# EAGLE board ESP32 Display 5.0 inch V1.2 (EAGLE 9.5.1), part 1 of 2
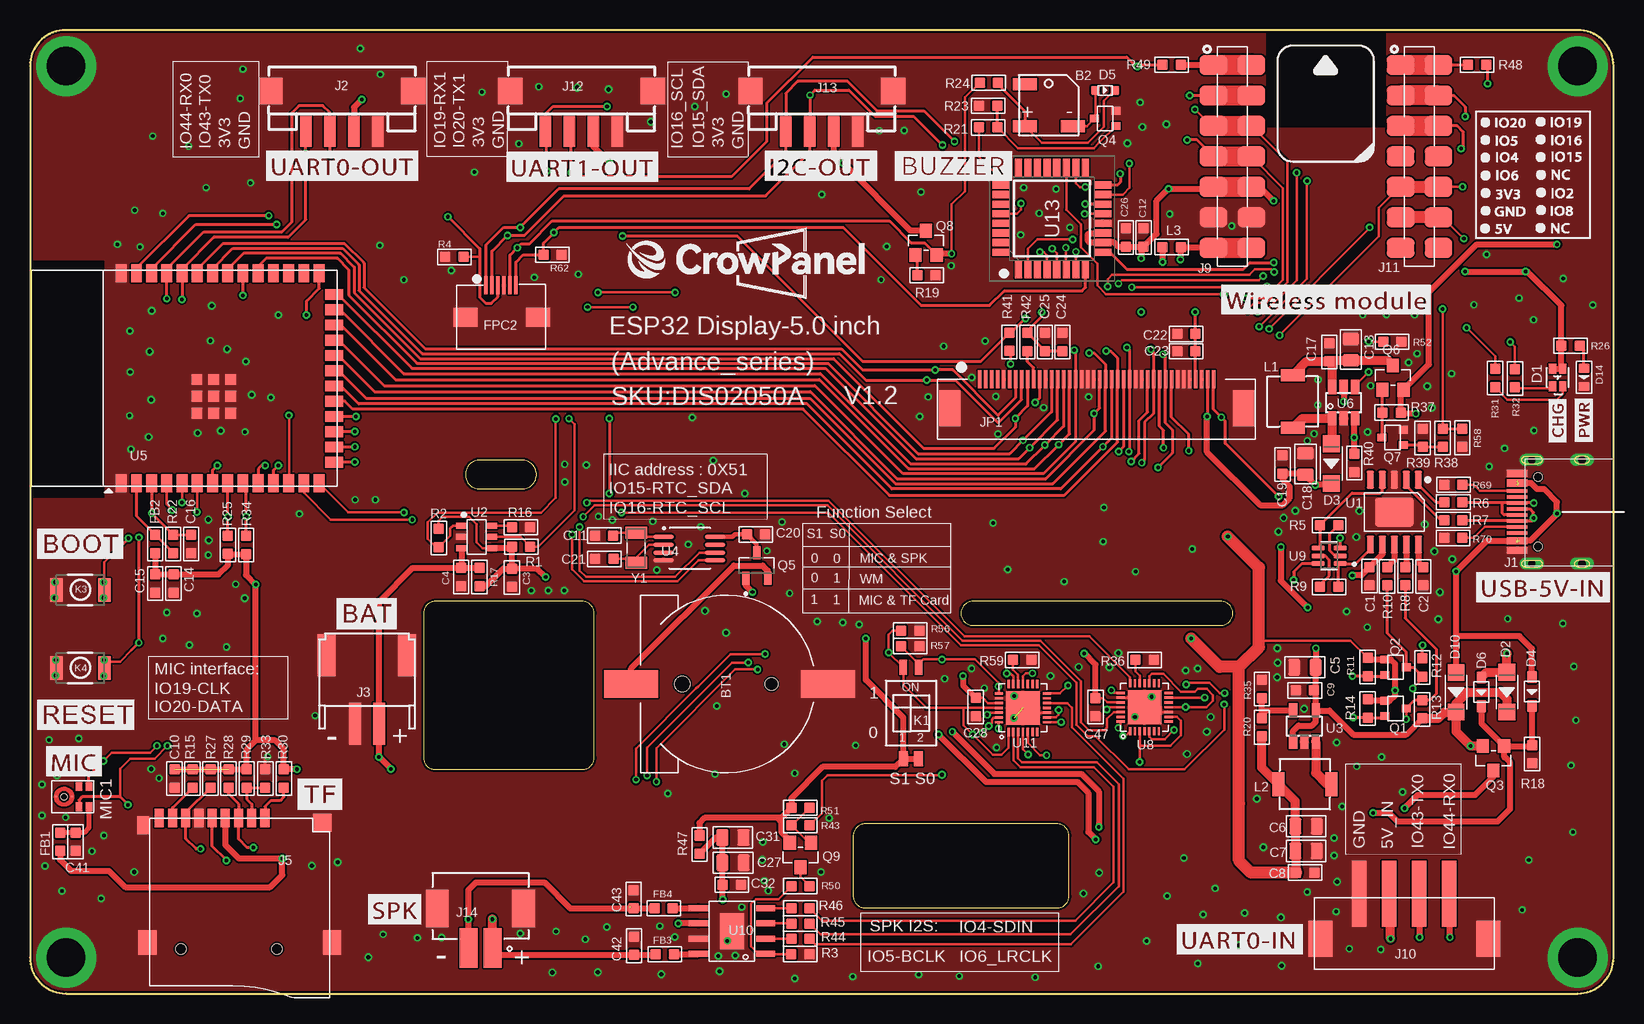
[diagram p5: board, top side]
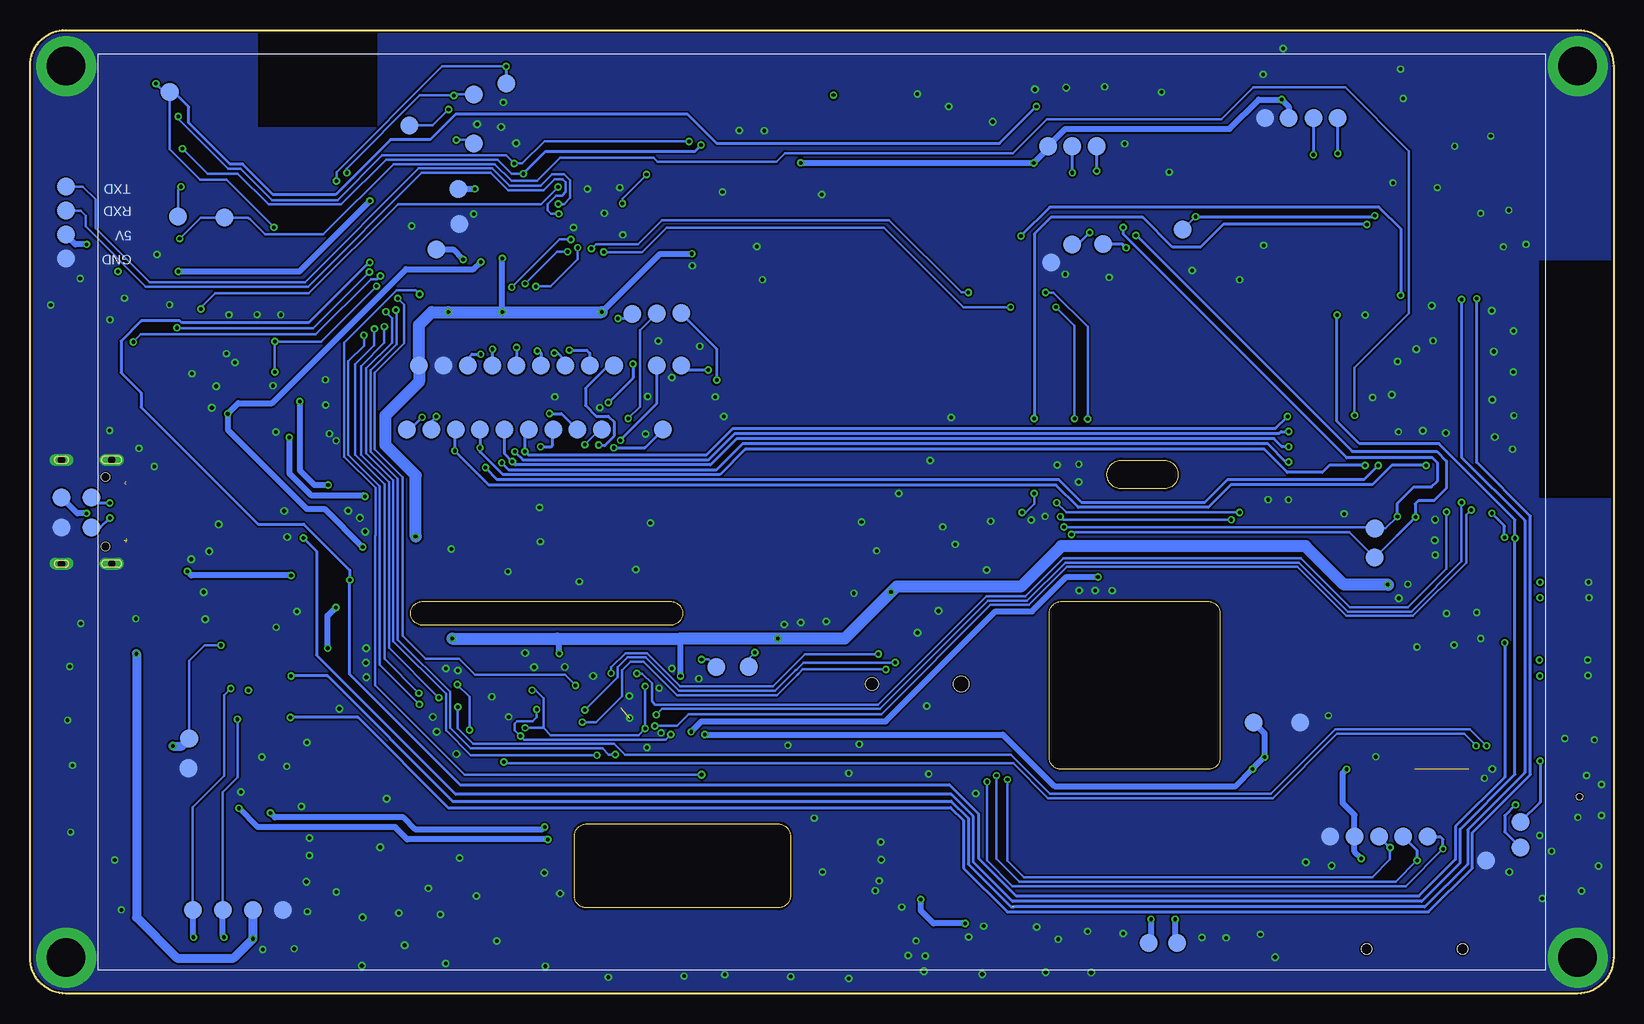
[diagram p6: board, bottom side, seen from below]

Size 132 x 80.3 mm. Coordinates in mm from the lower left corner, seen from the top.
Outline: 129,80.3 3,80.3 arc90 0,77.3 0,3 arc90 3,0 129,0 arc90 132,3 132,77.3 arc90 129,80.3
Outline: 78.61,30.69 99.27,30.69 arc180 99.27,32.69 78.61,32.69 arc180 78.61,30.69
Outline: 32.8,31.68 32.8,19.68 arc90 33.8,18.68 46.03,18.68 arc90 47.03,19.68 47.03,31.68 arc90 46.03,32.68 33.8,32.68 arc90 32.8,31.68
Outline: 69.61,7.14 85.61,7.14 arc90 86.61,8.14 86.61,13.14 arc90 85.61,14.14 69.61,14.14 arc90 68.61,13.14 68.61,8.14 arc90 69.61,7.14
Outline: 37.5,42.05 41.02,42.05 arc180 41.02,44.46 37.5,44.46 arc180 37.5,42.05
Copper layers (1*16): Top 0.035mm / dielectric 1.5mm / Bottom 0.035mm
Design rules "default *": minimum track width 8mil, minimum drill 0.3mm, track to track 6mil, track to pad 6mil, pad to pad 4mil, via to via 6mil, smd to smd 6mil, copper to edge 6mil, drill to drill 4mil, minimum pad ring 6mil, minimum via ring 6mil, stop-mask expansion 4mil, vias tented up to drill 100mil, thermal gap 0mil
tKeepout: area 0.5,41.9 to 6.5,62.6
tRestrict: area 0,41.3 to 6.2,61.1; area 103.1,72.2 to 113,80.3
bRestrict: area 0,41.3 to 6.2,61.1; area 103,72.2 to 113,80.3

## Footprints (pad centres in the part's own frame; a part is rotated, then mirrored left to right if it is on the bottom)
BEEP_5025 = smd 2 x 1: 1 -2,-1.75; 2 2,-1.75; 3 -2,1.75
CR1220 = smd 2.3 x 4.5: N 0,8.425; P 0,-7.975 | hole 1.3: 0,-3.725 | hole 1.05: 0,3.725
C0603 = smd 0.889 x 0.889: 1 -0.762,0; 2 0.762,0
C0805 = smd 1.016 x 1.397: 1 -0.889,0; 2 0.889,0
LED_KT-0603RYG = smd 0.85 x 0.6: 1 0.725,-0.425; 2 0.725,0.425; 3 -0.725,-0.425; 4 -0.725,0.425
D_SOD123FL = smd 1.397 x 1.397: + -1.651,0; - 1.651,0
D_SOD323 = smd 1 x 0.8: + -1.2,0; - 1.2,0
D_SOD523 = smd 0.762 x 0.7: + -0.8,0; - 0.8,0
LED0603 = smd 0.762 x 0.889: + -0.762,0; - 0.762,0
L0603 = smd 0.889 x 0.889: 1 -0.762,0; 2 0.762,0
FPC-6PIN-0.5MM = smd 0.3 x 1.5: 1 -1.31,2.184; 2 -0.81,2.184; 3 -0.31,2.184; 4 0.19,2.184; 5 0.69,2.184; 6 1.19,2.184 | smd 2 x 1.6: 7 -3.01,-0.496; 8 3.036,-0.496
USB-3.0TYPEC-SMD = smd 0.3 x 1.7: A1 -3.35,0.5; A4 -2.55,0.5; A5 -1.25,0.5; A6 -0.25,0.5; A7 0.25,0.5; A8 1.25,0.5; A9 2.55,0.5; A12 3.35,0.5; B1 3.05,0.5; B4 2.25,0.5; B5 1.75,0.5; B6 0.75,0.5; B7 -0.75,0.5; B8 -1.75,0.5; B9 -2.25,0.5; B12 -3.05,0.5 | drill 0.6 pad 1.016 long: P$1 -4.325,-0.72; P$2 4.325,-0.72; P$3 -4.325,-4.9; P$4 4.325,-4.9 | hole 0.68: -2.89,-1.22; 2.89,-1.22
CONNECTOR_4P-SMD-2.0 = smd 0.965 x 2.54: 1 -3,0; 2 -1,0; 3 1,0; 4 3,0 | smd 2.032 x 2.184: SS1 -5.946,3.4; SS2 5.946,3.4
PH2.0WT-2PIN = smd 1 x 3.5: P$1 -1,0; P$2 1,0 | smd 1.5 x 3.5: P$3 -3.35,-5.7; P$4 3.35,-5.7
THO-M3.2*5MM-HOLE = drill 3.2 pad 5: P$1 0,0
9P-SMD-W/-RING = smd 1.524 x 0.762: 1 0,4.4; 2 0,3.3; 3 0,2.2; 4 0,1.1; 5 0,0; 6 0,-1.1; 7 0,-2.2; 8 0,-3.3; 9 0,-4.4 | smd 1.524 x 1.016: G1 0.6,-5.746 | smd 2.032 x 1.524: G2 10.373,-5.4; G3 10.373,10 | smd 1.524 x 1.524: G4 0.392,9.181 | hole 0.889: 10.9,-2.6; 10.9,5.4
H7-2.54-18.28X2.5X5MM = smd 1.65 x 2.3: 1 -7.62,-1.58; 1-1 -7.62,1.58; 2 -5.08,-1.58; 2-2 -5.08,1.58; 3 -2.54,-1.58; 3-3 -2.54,1.58; 4 0,-1.58; 4-4 0,1.58; 5 2.54,-1.58; 5-5 2.54,1.58; 6 5.08,-1.58; 6-6 5.08,1.58; 7 7.62,-1.58; 7-7 7.62,1.58
XH2.54-4P-SMD = smd 1.2 x 5.5: 1 -3.75,-1.875; 2 -1.25,-1.875; 3 1.25,-1.875; 4 3.75,-1.875 | smd 2 x 3: 5 -7,1.875; 6 7,1.875
CONN-TH_2P-P2.00_XUNPU_WAFER-PH2.0-2PLB = smd 1.5 x 3.3: 1 -1,1.65; 2 1,1.65 | smd 1.9 x 3.1: 3 3.6,-1.65; 4 -3.6,-1.65
TEST-PIN-4-2.0MM = smd 1.5 x 1.5: 1 -3,0; 2 -1,0; 3 1,0; 4 3,0
COOPER_0.5MM*40P = smd 0.3 x 1.5: P$1 -8.81,1.73; P$2 -8.31,1.73; P$3 -7.81,1.73; P$4 -7.31,1.73; P$5 -6.81,1.73; P$6 -6.31,1.73; P$7 -5.81,1.73; P$8 -5.31,1.73; P$9 -4.81,1.73; P$10 -4.31,1.73; P$11 -3.81,1.73; P$12 -3.31,1.73; P$13 -2.81,1.73; P$14 -2.31,1.73; P$15 -1.81,1.73; P$16 -1.31,1.73; P$17 -0.81,1.73; P$18 -0.31,1.73; P$19 0.19,1.73; P$20 0.69,1.73; P$21 1.19,1.73; P$22 1.69,1.73; P$23 2.19,1.73; P$24 2.69,1.73; P$25 3.19,1.73; P$26 3.69,1.73; P$27 4.19,1.73; P$28 4.69,1.73; P$29 5.19,1.73; P$30 5.69,1.73; P$31 6.19,1.73; P$32 6.69,1.73; P$33 7.19,1.73; P$34 7.69,1.73; P$35 8.19,1.73; P$36 8.69,1.73; P$37 9.19,1.73; P$38 9.69,1.73; P$39 10.19,1.73; P$40 10.69,1.73 | smd 1.8 x 3: P$41 -11.31,-0.67; P$42 13.19,-0.67
SW-SMD_DSHP02TS-S_1 = smd 0.76 x 1.27: 1 -0.635,-3.81; 2 0.635,-3.81 | smd 0.635 x 1.27: 3 0.635,3.81; 4 -0.635,3.81
157SW = smd 1.016 x 1.981: 1 -2,0; 2 2,0
L0420 = smd 2 x 1: 1 0,2.2; 2 0,-2.2
MIC-SMD_5P-L3.5-W2.7-P1.67 = smd 0.725 x 0.522: 1 -0.838,1.362; 2 -0.838,0.542; 3 0.838,0.542; 4 0.838,1.362 | smd 0.25 x 0.25: 5_1 0,-0.048; 5_2 0,-1.373 | hole 0.5: 0,-0.71
TEST_PAD-1.5MM = smd 1.5 x 1.5: P$1 0,0
MOS_SOT323 = smd 0.635 x 0.762: 1 -0.635,-0.889; 2 0.635,-0.889; 3 0,0.889
PMOS_SOT23 = smd 1.016 x 1.143: 1 -0.889,-1.016; 2 0.889,-1.016; 3 0,1.016
SOT-23 = smd 1.09 x 0.61: 1 -1.07,0.915; 2 -1.07,-0.915; 3 1.07,0
R0603-SP = smd 0.889 x 0.889: 1 -0.762,0; 2 0.762,0
ESOP-10-EP-150MIL = smd 1.5 x 0.6: 1 -2.7,2; 2 -2.7,1; 3 -2.7,0; 4 -2.7,-1; 5 -2.7,-2; 6 2.7,-2; 7 2.7,-1; 8 2.7,0; 9 2.7,1; 10 2.7,2 | smd 2.4 x 3.2: EP 0,0
SOT23-6L = smd 0.5 x 0.9: 1 -0.961,-1.212; 2 -0.011,-1.212; 3 0.94,-1.212; 4 0.94,1.288; 5 -0.011,1.288; 6 -0.961,1.288
IC_SOT23-5 = smd 0.69 x 1.2: 1 -0.95,-1.3; 2 0,-1.3; 3 0.95,-1.3; 4 0.95,1.3; 5 -0.95,1.3
MSOP-8 = smd 0.364 x 1.692: 1 -0.975,-2.146; 2 -0.325,-2.146; 3 0.325,-2.146; 4 0.975,-2.146; 5 0.975,2.146; 6 0.325,2.146; 7 -0.325,2.146; 8 -0.975,2.146
ESP32-S3-WROOM-1-SMD41 = smd 1.5 x 0.9: 1 -8.75,5.26; 2 -8.75,3.99; 3 -8.75,2.72; 4 -8.75,1.45; 5 -8.75,0.18; 6 -8.75,-1.09; 7 -8.75,-2.36; 8 -8.75,-3.63; 9 -8.75,-4.9; 10 -8.75,-6.17; 11 -8.75,-7.44; 12 -8.75,-8.71; 13 -8.75,-9.98; 14 -8.75,-11.25; 27 8.75,-11.25; 28 8.75,-9.98; 29 8.75,-8.71; 30 8.75,-7.44; 31 8.75,-6.17; 32 8.75,-4.9; 33 8.75,-3.63; 34 8.75,-2.36; 35 8.75,-1.09; 36 8.75,0.18; 37 8.75,1.45; 38 8.75,2.72; 39 8.75,3.99; 40 8.75,5.26 | smd 0.9 x 1.5: 15 -6.985,-12.5; 16 -5.715,-12.5; 17 -4.445,-12.5; 18 -3.175,-12.5; 19 -1.905,-12.5; 20 -0.635,-12.5; 21 0.635,-12.5; 22 1.905,-12.5; 23 3.175,-12.5; 24 4.445,-12.5; 25 5.715,-12.5; 26 6.985,-12.5 | smd 0.9 x 0.9: 41 -2.9,-1.06; 42 -1.5,-1.06; 43 -0.1,-1.06; 44 -2.9,-2.46; 45 -1.5,-2.46; 46 -0.1,-2.46; 47 -2.9,-3.86; 48 -1.5,-3.86; 49 -0.1,-3.86
COOPER_SOT23-6 = smd 0.69 x 1.2: 1 -0.95,-1.3; 2 0,-1.3; 3 0.95,-1.3; 4 0.95,1.3; 5 0,1.3; 6 -0.95,1.3
QFN-28_L4.0-W4.0-P0.40-BL-EP2.8 = smd 0.2 x 0.7: 1 -1.2,-2; 2 -0.8,-2; 3 -0.4,-2; 4 0,-2; 5 0.4,-2; 6 0.8,-2; 7 1.2,-2; 15 1.2,2; 16 0.8,2; 17 0.4,2; 18 0,2; 19 -0.4,2; 20 -0.8,2; 21 -1.2,2 | smd 0.7 x 0.2: 8 2,-1.2; 9 2,-0.8; 10 2,-0.4; 11 2,0; 12 2,0.4; 13 2,0.8; 14 2,1.2; 22 -2,1.2; 23 -2,0.8; 24 -2,0.4; 25 -2,0; 26 -2,-0.4; 27 -2,-0.8; 28 -2,-1.2 | smd 2.8 x 2.8: 29 0,0
SOP65P210X100-6N = smd 1.09 x 0.4: 1 -0.92,0.65; 2 -0.92,0; 3 -0.92,-0.65; 4 0.92,-0.65; 5 0.92,0; 6 0.92,0.65
NS4168-ESOP-8 = smd 1.6 x 0.5: 1 -2.8,1.905; 2 -2.8,0.635; 3 -2.8,-0.635; 4 -2.8,-1.905; 5 2.8,-1.905; 6 2.8,-0.635; 7 2.8,0.635; 8 2.8,1.905 | smd 2 x 3: 9 0,0
QFP80P900X900X165-32N = smd 1.475 x 0.6: 1 -4.238,2.8; 2 -4.238,2; 3 -4.238,1.2; 4 -4.238,0.4; 5 -4.238,-0.4; 6 -4.238,-1.2; 7 -4.238,-2; 8 -4.238,-2.8; 17 4.238,-2.8; 18 4.238,-2; 19 4.238,-1.2; 20 4.238,-0.4; 21 4.238,0.4; 22 4.238,1.2; 23 4.238,2; 24 4.238,2.8 | smd 0.6 x 1.475: 9 -2.8,-4.238; 10 -2,-4.238; 11 -1.2,-4.238; 12 -0.4,-4.238; 13 0.4,-4.238; 14 1.2,-4.238; 15 2,-4.238; 16 2.8,-4.238; 25 2.8,4.238; 26 2,4.238; 27 1.2,4.238; 28 0.4,4.238; 29 -0.4,4.238; 30 -1.2,4.238; 31 -2,4.238; 32 -2.8,4.238
SMD3215-2P = smd 1 x 1.8: 1 -1.25,0; 2 1.25,0

## Placement (x,y rotation side)
B2  BEEP_5025  [BEEP_5025]  84.93,74.04 0 top
BT1  CR1220  [CR1220]  58.1,25.8 270 top
C1  1uF  [C0603]  111.66,34.79 90 top
C2  1uF  [C0603]  116.16,34.78 90 top
C3  1uF  [C0603]  40.17,34.66 90 top
C4  NC/10uF  [C0603]  35.94,34.71 90 top
C5  22uF  [C0805]  106.28,27.19 0 top
C6  22uF  [C0805]  106.37,13.95 180 top
C7  22uF  [C0805]  106.37,11.88 180 top
C8  1uF  [C0603]  106.3,10.08 180 top
C9  1uF  [C0603]  106.27,25.27 0 top
C10  1uF  [C0603]  12.05,17.92 90 top
C11  18pF  [C0603]  47.86,38.17 180 top
C12  10uF  [C0603]  92.83,63 270 top
C13  22uF  [C0805]  110.11,53.66 90 top
C14  10uF  [C0603]  11.96,34.17 90 top
C15  100nF  [C0603]  10.44,34.18 90 top
C16  1uF  [C0603]  13.44,37.46 90 top
C17  1uF  [C0603]  108.32,53.45 270 top
C18  22uF  [C0805]  106.32,44.13 90 top
C19  100nF  [C0603]  104.42,44.1 270 top
C20  1uF  [C0603]  60.52,38.27 0 top
C21  18pF  [C0603]  47.87,36.22 0 top
C22  4.7uF  [C0603]  96.39,54.97 0 top
C23  100nF  [C0603]  96.39,53.54 0 top
C24  10uF  [C0603]  86.06,54.3 270 top
C25  100nF  [C0603]  84.61,54.3 270 top
C26  100nF  [C0603]  91.35,63 270 top
C27  47uF  [C0805]  58.6,10.91 0 top
C28  1uF  [C0603]  78.84,23.87 90 top
C31  47uF  [C0805]  58.59,13 0 top
C32  100nF  [C0603]  58.5,9.06 0 top
C41  100nF  [C0603]  3.8,12.65 90 top
C42  1nF  [C0603]  50.34,3.99 270 top
C43  1nF  [C0603]  50.32,7.87 270 top
C47  1uF  [C0603]  88.83,23.87 270 top
D1  KT-0603RYG  [LED_KT-0603RYG]  127.35,51.35 90 top
D2  DSS34  [D_SOD123FL]  123.11,25.12 270 top
D3  DSS34  [D_SOD123FL]  108.48,44.16 270 top
D4  1N5817WS  [D_SOD323]  125.21,25.18 270 top
D5  B5819WT  [D_SOD523]  89.62,75.27 0 top
D6  1N5817WS  [D_SOD323]  120.98,25.15 270 top
D10  DSS34  [D_SOD123FL]  118.88,25.11 270 top
D14  Red  [LED0603]  129.54,51.36 270 top
FB1  0R/800mA  [L0603]  2.52,12.65 90 top
FB2  0R/800mA  [L0603]  10.44,37.48 90 top
FB3  1K/300mA  [L0603]  52.92,3.29 180 top
FB4  1K/300mA  [L0603]  52.82,7.11 180 top
FPC2  FPC-6PIN-0.5MM  [FPC-6PIN-0.5MM]  39.32,56.85 0 top
J1  TYPEC-3.0-16P-SMD  [USB-3.0TYPEC-SMD]  124.47,40.15 90 top
J2  HY2.0-4P-SMT  [CONNECTOR_4P-SMD-2.0]  26.01,71.82 0 top
J3  PH2.0WT-2PIN  [PH2.0WT-2PIN]  28.09,22.51 180 top
J4  THO-M3.25MM-HOLE  [THO-M3.2*5MM-HOLE]  129,3 0 top
J5  [9P-SMD-W/-RING]  15.18,14.62 270 top
J6  THO-M3.25MM-HOLE  [THO-M3.2*5MM-HOLE]  3,3 0 top
J7  THO-M3.25MM-HOLE  [THO-M3.2*5MM-HOLE]  129,77.3 0 top
J8  THO-M3.25MM-HOLE  [THO-M3.2*5MM-HOLE]  3,77.3 0 top
J9  [H7-2.54-18.28X2.5X5MM]  100.23,69.76 270 top
J10  XH2.54-4P-SMT  [XH2.54-4P-SMD]  114.56,6.45 180 top
J11  [H7-2.54-18.28X2.5X5MM]  115.83,69.76 270 top
J12  HY2.0-4P-SMT  [CONNECTOR_4P-SMD-2.0]  45.97,71.82 0 top
J13  HY2.0-4P-SMT  [CONNECTOR_4P-SMD-2.0]  66.01,71.82 0 top
J14  WAFER-PH2.0-2PLB  [CONN-TH_2P-P2.00_XUNPU_WAFER-PH2.0-2PLB]  37.55,5.44 180 top
J15  HC-PZ200-8.7L-1X4PZ1  [TEST-PIN-4-2.0MM]  129.01,64.24 270 bottom
JP1  COOPER_0.5MM-40PIN40PIN  [COOPER_0.5MM*40P]  87.97,49.45 0 top
K1  DSHP02TS-S  [SW-SMD_DSHP02TS-S_1]  73.44,23.38 0 top
K3  [157SW]  4.21,33.64 0 top
K4  [157SW]  4.21,27.14 0 top
L1  4.7uH/3A  [L0420]  105.26,49.34 0 top
L2  4.7uH/3A  [L0420]  106.27,17.46 270 top
L3  NC  [L0603]  95.17,62.21 180 top
MIC1  LMD3526B261-OFA01  [MIC-SMD_5P-L3.5-W2.7-P1.67]  3.55,16.41 270 top
P1  TEST_PADPAD-1.5MM  [TEST_PAD-1.5MM]  129.38,41.34 0 bottom
P2  TEST_PADPAD-1.5MM  [TEST_PAD-1.5MM]  126.88,41.34 0 bottom
P3  TEST_PADPAD-1.5MM  [TEST_PAD-1.5MM]  126.88,38.84 0 bottom
P4  TEST_PADPAD-1.5MM  [TEST_PAD-1.5MM]  129.38,38.84 0 bottom
P5  TEST_PADPAD-1.5MM  [TEST_PAD-1.5MM]  115.78,64.67 180 bottom
P6  TEST_PADPAD-1.5MM  [TEST_PAD-1.5MM]  10.61,11.09 270 bottom
P7  TEST_PADPAD-1.5MM  [TEST_PAD-1.5MM]  15.49,13.08 0 bottom
P8  TEST_PADPAD-1.5MM  [TEST_PAD-1.5MM]  17.53,13.08 270 bottom
P9  TEST_PADPAD-1.5MM  [TEST_PAD-1.5MM]  29.99,22.58 180 bottom
P10  TEST_PADPAD-1.5MM  [TEST_PAD-1.5MM]  26.11,22.59 180 bottom
P11  TEST_PADPAD-1.5MM  [TEST_PAD-1.5MM]  118.73,21.24 0 bottom
P12  TEST_PADPAD-1.5MM  [TEST_PAD-1.5MM]  118.79,18.78 0 bottom
P13  TEST_PADPAD-1.5MM  [TEST_PAD-1.5MM]  21.59,13.08 0 bottom
P14  TEST_PADPAD-1.5MM  [TEST_PAD-1.5MM]  119.66,64.74 180 bottom
P17  TEST_PADPAD-1.5MM  [TEST_PAD-1.5MM]  113.42,6.97 0 bottom
P18  TEST_PADPAD-1.5MM  [TEST_PAD-1.5MM]  110.92,6.97 0 bottom
P19  TEST_PADPAD-1.5MM  [TEST_PAD-1.5MM]  115.92,6.97 0 bottom
P20  TEST_PADPAD-1.5MM  [TEST_PAD-1.5MM]  118.42,6.97 0 bottom
P21  TEST_PADPAD-1.5MM  [TEST_PAD-1.5MM]  74.81,27.21 0 bottom
P22  TEST_PADPAD-1.5MM  [TEST_PAD-1.5MM]  100.38,72.35 0 bottom
P23  TEST_PADPAD-1.5MM  [TEST_PAD-1.5MM]  95,74.94 0 bottom
P24  TEST_PADPAD-1.5MM  [TEST_PAD-1.5MM]  95,70.85 0 bottom
P25  TEST_PADPAD-1.5MM  [TEST_PAD-1.5MM]  72.09,27.24 0 bottom
P26  TEST_PADPAD-1.5MM  [TEST_PAD-1.5MM]  19.56,13.08 270 bottom
P27  TEST_PADPAD-1.5MM  [TEST_PAD-1.5MM]  7.76,12.18 180 bottom
P28  TEST_PADPAD-1.5MM  [TEST_PAD-1.5MM]  23.62,13.08 0 bottom
P29  TEST_PADPAD-1.5MM  [TEST_PAD-1.5MM]  7.76,14.31 0 bottom
P31  TEST_PADPAD-1.5MM  [TEST_PAD-1.5MM]  38.74,4.22 0 bottom
P32  TEST_PADPAD-1.5MM  [TEST_PAD-1.5MM]  27.08,72.97 0 bottom
P33  TEST_PADPAD-1.5MM  [TEST_PAD-1.5MM]  25.02,72.95 180 bottom
P34  TEST_PADPAD-1.5MM  [TEST_PAD-1.5MM]  22.99,72.95 180 bottom
P35  TEST_PADPAD-1.5MM  [TEST_PAD-1.5MM]  43.08,70.61 0 bottom
P36  TEST_PADPAD-1.5MM  [TEST_PAD-1.5MM]  45.11,70.61 0 bottom
P37  TEST_PADPAD-1.5MM  [TEST_PAD-1.5MM]  29.03,72.97 0 bottom
P38  TEST_PADPAD-1.5MM  [TEST_PAD-1.5MM]  42.55,62.46 0 bottom
P39  TEST_PADPAD-1.5MM  [TEST_PAD-1.5MM]  19.9,36.33 0 bottom
P40  TEST_PADPAD-1.5MM  [TEST_PAD-1.5MM]  19.9,38.77 0 bottom
P41  TEST_PADPAD-1.5MM  [TEST_PAD-1.5MM]  46.89,60.94 0 bottom
P42  TEST_PADPAD-1.5MM  [TEST_PAD-1.5MM]  36.39,4.22 0 bottom
P43  TEST_PADPAD-1.5MM  [TEST_PAD-1.5MM]  47.14,70.61 0 bottom
P44  TEST_PADPAD-1.5MM  [TEST_PAD-1.5MM]  99.57,52.32 0 bottom
P45  TEST_PADPAD-1.5MM  [TEST_PAD-1.5MM]  97.54,52.32 0 bottom
P46  TEST_PADPAD-1.5MM  [TEST_PAD-1.5MM]  100.58,46.99 0 bottom
P47  TEST_PADPAD-1.5MM  [TEST_PAD-1.5MM]  98.55,46.99 0 bottom
P48  TEST_PADPAD-1.5MM  [TEST_PAD-1.5MM]  96.52,46.99 0 bottom
P49  TEST_PADPAD-1.5MM  [TEST_PAD-1.5MM]  95.5,52.32 0 bottom
P50  TEST_PADPAD-1.5MM  [TEST_PAD-1.5MM]  94.49,46.99 0 bottom
P51  TEST_PADPAD-1.5MM  [TEST_PAD-1.5MM]  93.47,52.32 0 bottom
P52  TEST_PADPAD-1.5MM  [TEST_PAD-1.5MM]  92.46,46.99 0 bottom
P53  TEST_PADPAD-1.5MM  [TEST_PAD-1.5MM]  91.44,52.32 0 bottom
P54  TEST_PADPAD-1.5MM  [TEST_PAD-1.5MM]  90.42,46.99 0 bottom
P55  TEST_PADPAD-1.5MM  [TEST_PAD-1.5MM]  89.41,52.32 0 bottom
P56  TEST_PADPAD-1.5MM  [TEST_PAD-1.5MM]  88.39,46.99 0 bottom
P57  TEST_PADPAD-1.5MM  [TEST_PAD-1.5MM]  87.38,52.32 0 bottom
P58  TEST_PADPAD-1.5MM  [TEST_PAD-1.5MM]  120.35,75.14 0 bottom
P59  TEST_PADPAD-1.5MM  [TEST_PAD-1.5MM]  92.3,75.85 180 bottom
P60  TEST_PADPAD-1.5MM  [TEST_PAD-1.5MM]  96.23,64.14 0 bottom
P61  TEST_PADPAD-1.5MM  [TEST_PAD-1.5MM]  96.28,67.07 0 bottom
P62  TEST_PADPAD-1.5MM  [TEST_PAD-1.5MM]  98.13,62.01 0 bottom
P63  TEST_PADPAD-1.5MM  [TEST_PAD-1.5MM]  86.36,46.99 0 bottom
P64  TEST_PADPAD-1.5MM  [TEST_PAD-1.5MM]  85.34,52.32 0 bottom
P65  TEST_PADPAD-1.5MM  [TEST_PAD-1.5MM]  84.33,46.99 0 bottom
P66  TEST_PADPAD-1.5MM  [TEST_PAD-1.5MM]  83.31,52.32 0 bottom
P67  TEST_PADPAD-1.5MM  [TEST_PAD-1.5MM]  79.25,46.99 0 bottom
P68  TEST_PADPAD-1.5MM  [TEST_PAD-1.5MM]  79.76,52.32 0 bottom
P69  TEST_PADPAD-1.5MM  [TEST_PAD-1.5MM]  81.79,56.65 0 bottom
P70  TEST_PADPAD-1.5MM  [TEST_PAD-1.5MM]  79.76,56.68 0 bottom
P71  TEST_PADPAD-1.5MM  [TEST_PAD-1.5MM]  77.72,56.7 0 bottom
P72  TEST_PADPAD-1.5MM  [TEST_PAD-1.5MM]  77.72,52.32 0 bottom
P75  TEST_PADPAD-1.5MM  [TEST_PAD-1.5MM]  35.92,63.67 0 bottom
P76  TEST_PADPAD-1.5MM  [TEST_PAD-1.5MM]  45.14,62.42 0 bottom
Q1  BSS138W_SOT323  [MOS_SOT323]  113.84,23.76 270 top
Q2  BSS138W_SOT323  [MOS_SOT323]  113.84,27.19 270 top
Q3  AO3401  [PMOS_SOT23]  121.99,19.61 180 top
Q4  SS8050W-SOT323  [MOS_SOT323]  89.63,72.94 90 top
Q5  BAT54C-7-F  [SOT-23]  60.57,35.67 90 top
Q6  AO3401  [PMOS_SOT23]  113.61,51.34 0 top
Q7  SS8050W-SOT323  [MOS_SOT323]  113.59,46.36 90 top
Q8  AO3401  [PMOS_SOT23]  74.69,62.56 0 top
Q9  AO3401  [PMOS_SOT23]  64.23,11.55 180 top
R1  5.1K  [R0603-SP]  40.94,37.24 180 top
R2  5.1K  [R0603-SP]  34.08,37.97 90 top
R3  100K  [R0603-SP]  64.22,3.29 0 top
R4  5.1K  [R0603-SP]  35.38,61.39 0 top
R5  10K  [R0603-SP]  108.29,39.04 180 top
R6  0R  [R0603-SP]  118.65,40.94 0 top
R7  0R  [R0603-SP]  118.65,39.46 0 top
R8  0R  [R0603-SP]  114.64,34.79 90 top
R9  10K  [R0603-SP]  108.29,33.89 0 top
R10  0R  [R0603-SP]  113.13,34.78 90 top
R11  4.7K  [R0603-SP]  111.5,27.21 270 top
R12  4.7K  [R0603-SP]  116.07,27.17 270 top
R13  4.7K  [R0603-SP]  116.05,23.69 90 top
R14  4.7K  [R0603-SP]  111.5,23.76 270 top
R15  10K  [R0603-SP]  13.55,17.92 90 top
R16  2K  [R0603-SP]  40.93,38.86 180 top
R17  5.1K  [R0603-SP]  37.46,34.72 270 top
R18  10K  [R0603-SP]  125.21,19.95 90 top
R19  10K  [R0603-SP]  74.73,59.87 180 top
R20  45.3K  [R0603-SP]  102.68,22.2 270 top
R21  1K  [R0603-SP]  79.87,72.18 180 top
R22  10K  [R0603-SP]  11.95,37.46 90 top
R23  47K  [R0603-SP]  79.87,73.99 180 top
R24  3.9R  [R0603-SP]  79.94,75.9 180 top
R25  4.7K  [R0603-SP]  16.5,37.4 270 top
R26  5.1K  [R0603-SP]  128.41,53.98 180 top
R27  10K  [R0603-SP]  15.04,17.92 90 top
R28  10K  [R0603-SP]  16.54,17.92 90 top
R29  10K/NC  [R0603-SP]  18.07,17.92 90 top
R30  10K  [R0603-SP]  21.17,17.92 90 top
R31  2K  [R0603-SP]  122.13,51.29 90 top
R32  5.1K  [R0603-SP]  123.79,51.27 90 top
R33  10K  [R0603-SP]  19.62,17.92 90 top
R34  4.7K  [R0603-SP]  18.02,37.38 270 top
R35  10K  [R0603-SP]  102.68,25.39 270 top
R36  10K  [R0603-SP]  92.91,27.8 0 top
R37  100K  [R0603-SP]  113.51,48.42 0 top
R38  100R  [R0603-SP]  117.76,46.31 90 top
R39  10K  [R0603-SP]  116.09,46.31 90 top
R40  3.6R  [R0603-SP]  110.39,44.23 90 top
R41  0R  [R0603-SP]  81.64,54.32 90 top
R42  10K  [R0603-SP]  83.14,54.3 90 top
R43  100R  [R0603-SP]  64.23,14.02 180 top
R44  0R  [R0603-SP]  64.22,4.57 0 top
R45  0R  [R0603-SP]  64.23,5.84 0 top
R46  0R  [R0603-SP]  64.23,7.12 0 top
R47  0R  [R0603-SP]  55.8,12.41 90 top
R48  0R  [R0603-SP]  120.61,77.4 0 top
R49  0R  [R0603-SP]  95.17,77.39 180 top
R50  1K  [R0603-SP]  64.23,8.96 0 top
R51  10K  [R0603-SP]  64.23,15.49 180 top
R52  10K  [R0603-SP]  113.56,54.31 180 top
R56  10K  [R0603-SP]  73.37,30.25 0 top
R57  10K  [R0603-SP]  73.37,28.96 0 top
R58  10K/NC  [R0603-SP]  119.4,46.32 90 top
R59  10K  [R0603-SP]  82.7,27.81 0 top
R62  5.1K  [R0603-SP]  43.56,61.56 180 top
R69  5.1K  [R0603-SP]  118.65,42.4 0 top
R70  5.1K  [R0603-SP]  118.64,37.97 180 top
U1  CH340K  [ESOP-10-EP-150MIL]  113.73,40.12 270 top
U2  TP4059-SOT23-6  [SOT23-6L]  37.18,38.05 270 top
U3  RY3420  [IC_SOT23-5]  106.23,22.29 0 top
U4  PCF8563MDTR(XBLW)  [MSOP-8]  54.97,37.08 270 top
U5  ESP32-S3-WROOM-1  [ESP32-S3-WROOM-1-SMD41]  12.86,51.27 90 top
U6  MT9201  [COOPER_SOT23-6]  109.5,49.25 0 top
U8  CH486F  [QFN-28_L4.0-W4.0-P0.40-BL-EP2.8]  92.91,23.86 0 top
U9  UMH3NTN  [SOP65P210X100-6N]  108.29,36.48 180 top
U10  NS4168-ESOP-8  [NS4168-ESOP-8]  58.52,5.21 180 top
U11  CH486F  [QFN-28_L4.0-W4.0-P0.40-BL-EP2.8]  82.77,23.81 0 top
U13  STC8H1K28-36I-LQFP32  [QFP80P900X900X165-32N]  85.19,64.59 90 top
Y1  32.768KHZ  [SMD3215-2P]  50.54,37.14 270 top